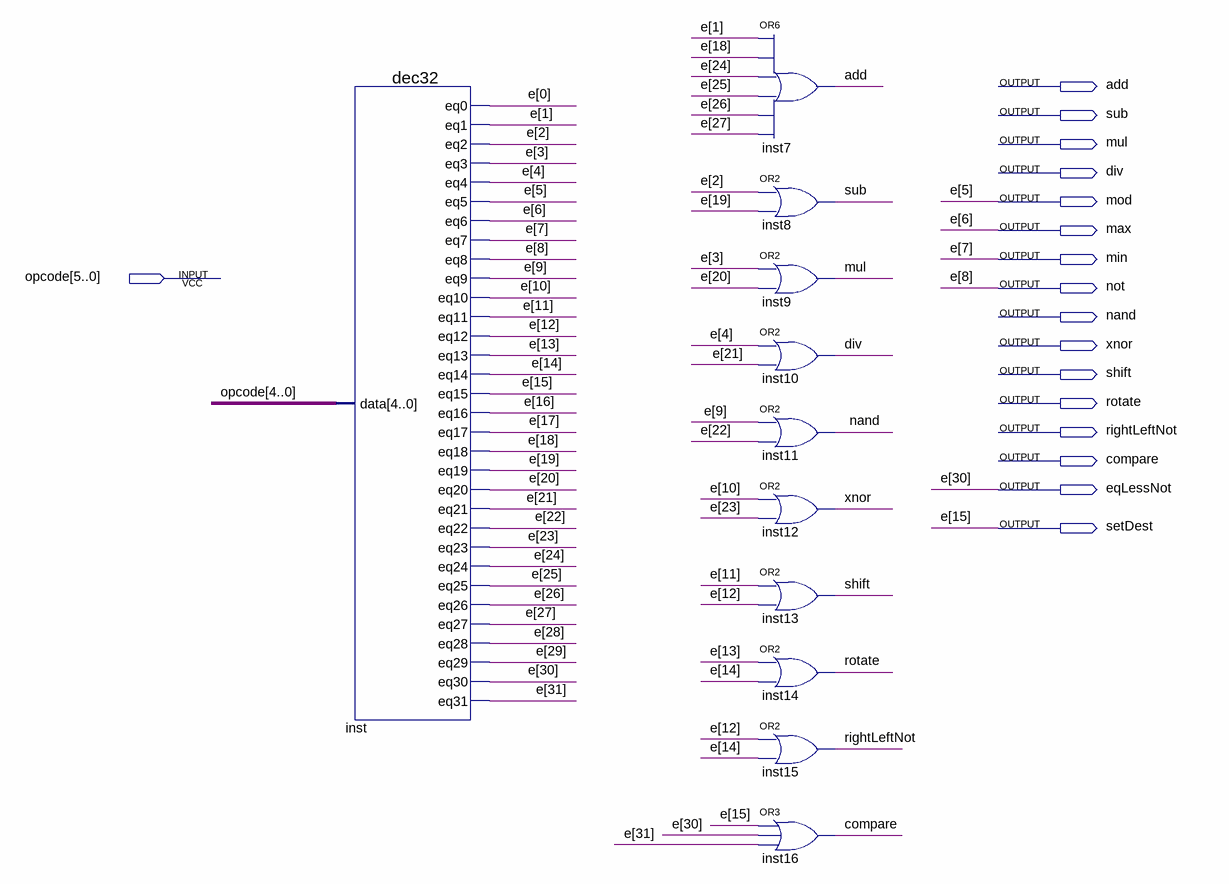
[diagram p0: schematic sheet]
// Quartus schematic ALU_DEC.bdf as structural Verilog: 11 symbols, 17 pins
module ALU_DEC (
  input  [5:0] opcode,
  output add,
  output sub,
  output mul,
  output div,
  output mod,
  output max,
  output min,
  output \not ,
  output \nand ,
  output \xnor ,
  output shift,
  output rotate,
  output rightLeftNot,
  output compare,
  output eqLessNot,
  output setDest
);

  wire [31:0] e;

  dec32 inst (
    .data(opcode[4:0]), .eq0(e[0]), .eq1(e[1]), .eq2(e[2]), .eq3(e[3]), .eq4(e[4]), .eq5(mod), .eq6(max),
    .eq7(min), .eq8(\not ), .eq9(e[9]), .eq10(e[10]), .eq11(e[11]), .eq12(e[12]), .eq13(e[13]), .eq14(e[14]),
    .eq15(setDest), .eq16(e[16]), .eq17(e[17]), .eq18(e[18]), .eq19(e[19]), .eq20(e[20]), .eq21(e[21]),
    .eq22(e[22]), .eq23(e[23]), .eq24(e[24]), .eq25(e[25]), .eq26(e[26]), .eq27(e[27]), .eq28(e[28]),
    .eq29(e[29]), .eq30(eqLessNot), .eq31(e[31]));
  or inst7 (add, e[1], e[18], e[24], e[25], e[26], e[27]);
  or inst8 (sub, e[2], e[19]);
  or inst9 (mul, e[3], e[20]);
  or inst10 (div, e[4], e[21]);
  or inst11 (\nand , e[9], e[22]);
  or inst12 (\xnor , e[10], e[23]);
  or inst13 (shift, e[11], e[12]);
  or inst14 (rotate, e[13], e[14]);
  or inst15 (rightLeftNot, e[12], e[14]);
  or inst16 (compare, setDest, eqLessNot, e[31]);

  // Other names for the same wires on the sheet: e (some bits) = {eqLessNot, setDest, \not , min, max, mod}
endmodule
